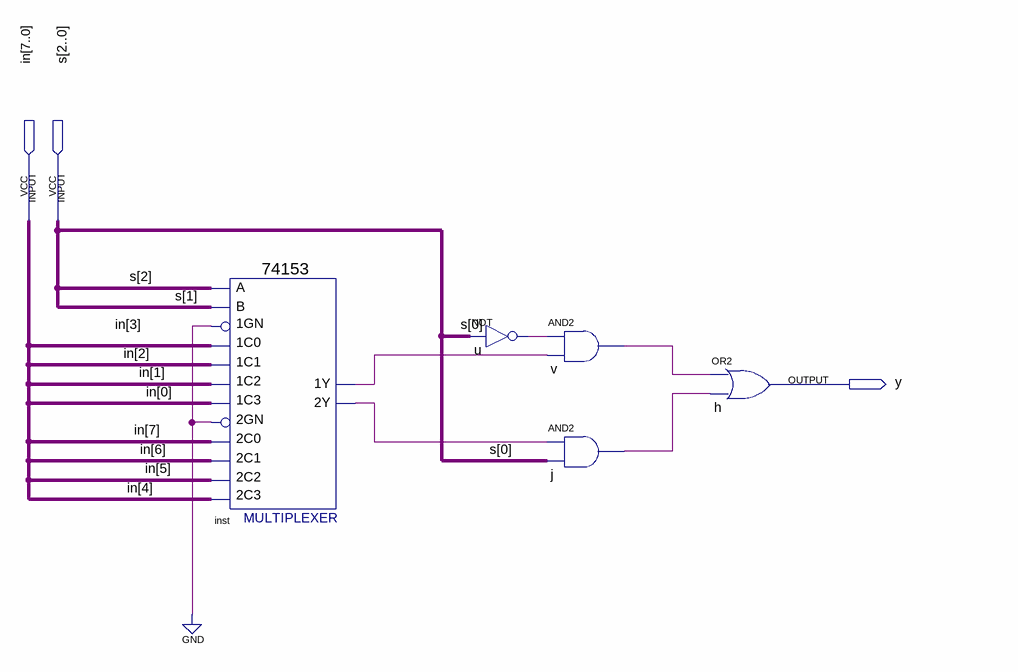
[diagram p0: schematic sheet]
// Quartus schematic Mux8_1.bdf as structural Verilog: 5 symbols, 3 pins
module Mux8_1 (
  input  [7:0] in,
  input  [2:0] s,
  output y
);

  wire inst_1y, inst_2y, j_out, u_out, v_out;

  \74153  inst (
    .\1C1 (in[2]), .\1GN (1'b0), .\1C0 (in[3]), .\2C0 (in[7]), .\2GN (1'b0), .\2C2 (in[5]), .\1C2 (in[1]),
    .\1C3 (in[0]), .B(s[1]), .A(s[2]), .\2C1 (in[6]), .\2C3 (in[4]), .\1Y (inst_1y), .\2Y (inst_2y));
  not u (u_out, s[0]);
  and v (v_out, u_out, inst_1y);
  and j (j_out, inst_2y, s[0]);
  or h (y, v_out, j_out);
endmodule
